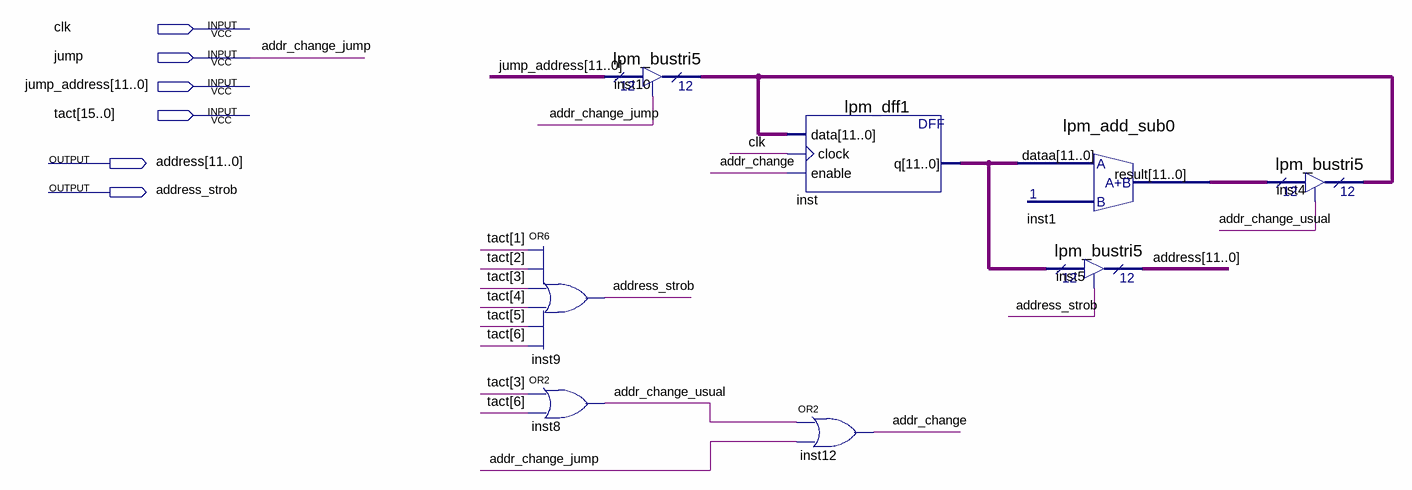
[diagram p0: schematic sheet]
// Quartus schematic instraction_pointer.bdf as structural Verilog: 8 symbols, 6 pins
module instraction_pointer (
  input  clk,
  input  jump,
  input  [11:0] jump_address,
  input  [15:0] tact,
  output [11:0] address,
  output address_strob
);

  wire addr_change, addr_change_usual;
  wire [11:0] inst1_result, inst10_tridata, inst_q;

  or inst9 (address_strob, tact[1], tact[2], tact[3], tact[4], tact[5], tact[6]);
  or inst8 (addr_change_usual, tact[3], tact[6]);
  lpm_bustri5 inst10 (.enabledt(jump), .data(jump_address), .tridata(inst10_tridata));
  lpm_dff1 inst (.data(inst10_tridata), .clock(clk), .enable(addr_change), .q(inst_q));
  or inst12 (addr_change, addr_change_usual, jump);
  lpm_add_sub0 inst1 (.dataa(inst_q), .result(inst1_result));
  lpm_bustri5 inst5 (.enabledt(address_strob), .data(inst_q), .tridata(address));
  lpm_bustri5 inst4 (.enabledt(addr_change_usual), .data(inst1_result), .tridata(inst10_tridata));

  // Other names for the same wires on the sheet: addr_change_jump = jump
endmodule
